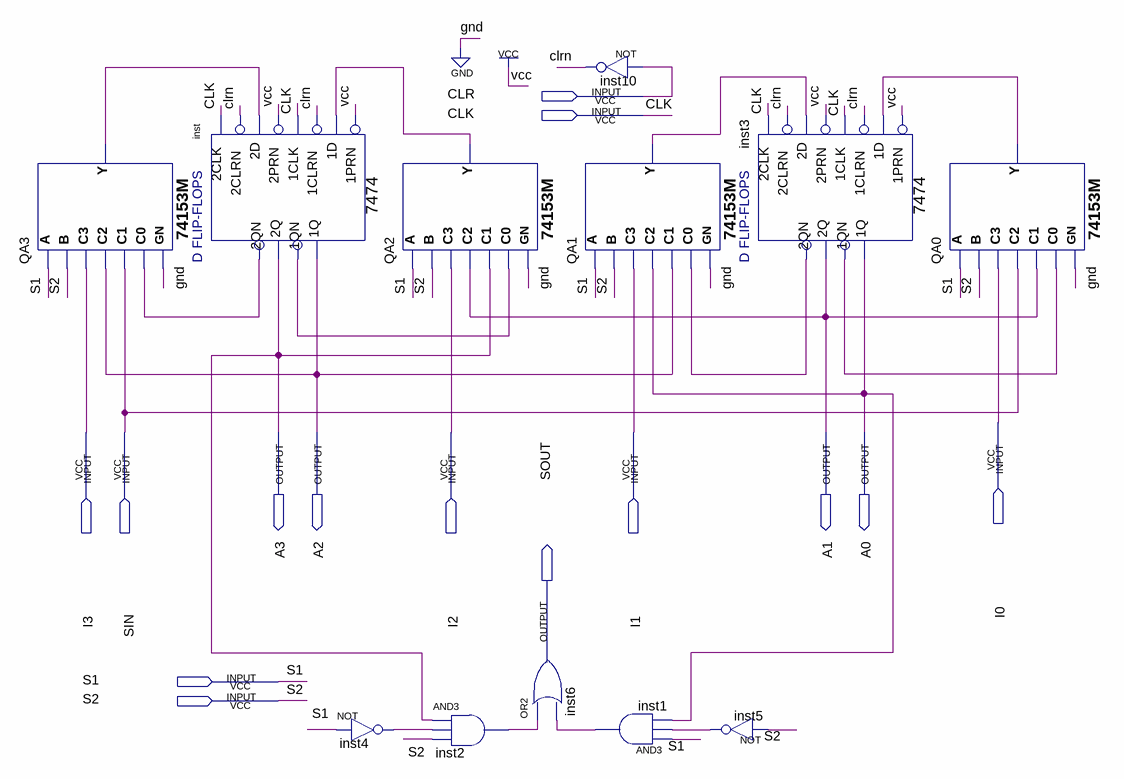
[diagram p0: schematic sheet]
// Quartus schematic Question1.bdf as structural Verilog: 12 symbols, 14 pins
module Question1 (
  input  CLR,
  input  CLK,
  input  I0,
  input  I3,
  input  SIN,
  input  I2,
  input  I1,
  input  S1,
  input  S2,
  output A3,
  output A2,
  output A1,
  output A0,
  output SOUT
);

  wire clrn, inst1_out, inst2_out, inst3_1qn, inst3_2qn, inst4_out, inst5_out, inst_1qn, inst_2qn, QA0_y,
       QA1_y, QA2_y, QA3_y;

  \74153M  QA3 (.A(S1), .B(S2), .C3(I3), .C2(A2), .C1(SIN), .C0(inst_2qn), .GN(1'b0), .Y(QA3_y));
  \7474  inst (
    .\2D (QA3_y), .\2PRN (1'b1), .\1CLK (CLK), .\1D (QA2_y), .\1PRN (1'b1), .\2CLK (CLK), .\2CLRN (clrn),
    .\1CLRN (clrn), .\1QN (inst_1qn), .\2Q (A3), .\2QN (inst_2qn), .\1Q (A2));
  not inst4 (inst4_out, S1);
  \74153M  QA2 (.A(S1), .B(S2), .C3(I2), .C2(A1), .C1(A3), .C0(inst_1qn), .GN(1'b0), .Y(QA2_y));
  and inst2 (inst2_out, A3, inst4_out, S2);
  not inst10 (clrn, CLR);
  \74153M  QA1 (.A(S1), .B(S2), .C3(I1), .C2(A0), .C1(A2), .C0(inst3_2qn), .GN(1'b0), .Y(QA1_y));
  or inst6 (SOUT, inst2_out, inst1_out);
  and inst1 (inst1_out, S1, inst5_out, A0);
  \7474  inst3 (
    .\2D (QA1_y), .\2PRN (1'b1), .\1CLK (CLK), .\1D (QA0_y), .\1PRN (1'b1), .\2CLK (CLK), .\2CLRN (clrn),
    .\1CLRN (clrn), .\1QN (inst3_1qn), .\2Q (A1), .\2QN (inst3_2qn), .\1Q (A0));
  not inst5 (inst5_out, S2);
  \74153M  QA0 (.A(S1), .B(S2), .C3(I0), .C2(SIN), .C1(A1), .C0(inst3_1qn), .GN(1'b0), .Y(QA0_y));
endmodule
